# Altium schematic sheet Badge.SchDoc
size A3
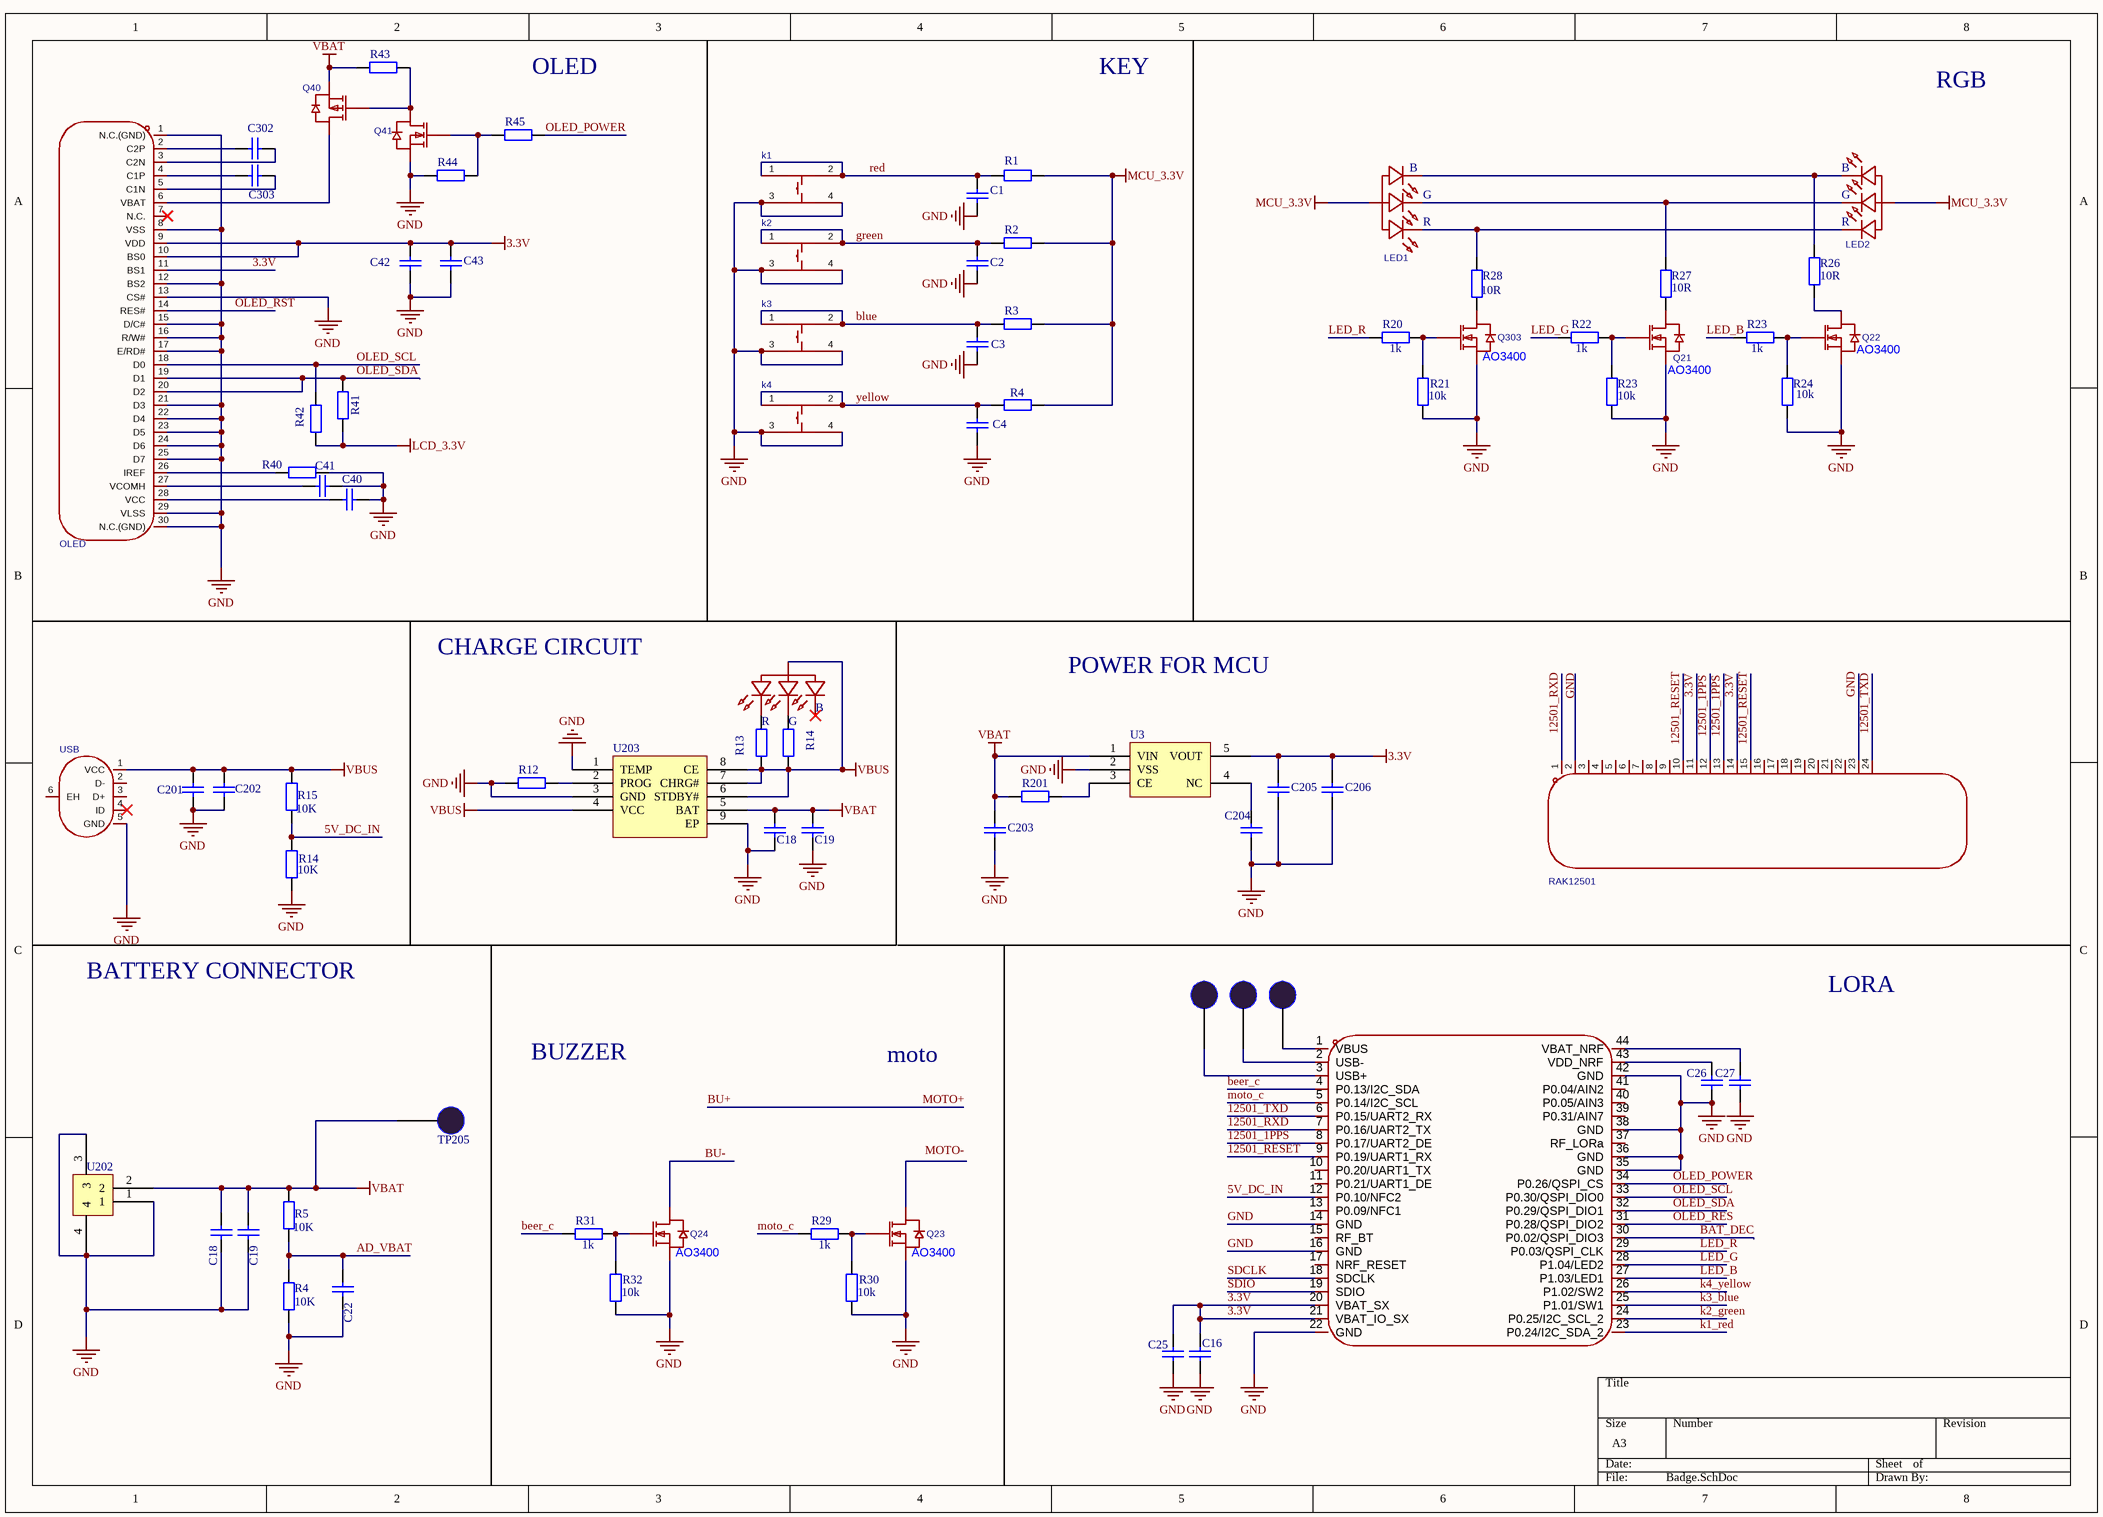
[diagram p0: Badge.SchDoc]

## Parts
(Parts that share a designator on the sheet are numbered #1, #2 ... from top to bottom, then left to right.)
?#1  TP201  (value not drawn)
?#2  TP201  (value not drawn)
?#3  TP201  (value not drawn)
C1  Cap  [RAD-0.3]  (value not drawn)
C2  Cap  [RAD-0.3]  (value not drawn)
C3  Cap  [RAD-0.3]  (value not drawn)
C4  Cap  [RAD-0.3]  (value not drawn)
C16  Cap  [RAD-0.3]  (value not drawn)
C18#1  Cap  [RAD-0.3]  (value not drawn)
C18#2  Cap  [RAD-0.3]  (value not drawn)
C19#1  Cap  [RAD-0.3]  (value not drawn)
C19#2  Cap  [RAD-0.3]  (value not drawn)
C22  Cap  [RAD-0.3]  (value not drawn)
C25  Cap  [RAD-0.3]  (value not drawn)
C26  Cap  [RAD-0.3]  (value not drawn)
C27  Cap  [RAD-0.3]  (value not drawn)
C40  Cap  [RAD-0.3]  (value not drawn)
C41  Cap  [RAD-0.3]  (value not drawn)
C42  Cap  [RAD-0.3]  (value not drawn)
C43  Cap  [RAD-0.3]  (value not drawn)
C201  Cap  [RAD-0.3]  (value not drawn)
C202  Cap  [RAD-0.3]  (value not drawn)
C203  Cap  [RAD-0.3]  (value not drawn)
C204  Cap  [RAD-0.3]  (value not drawn)
C205  Cap  [RAD-0.3]  (value not drawn)
C206  Cap  [RAD-0.3]  (value not drawn)
C302  Cap  [RAD-0.3]  (value not drawn)
C303  Cap  [RAD-0.3]  (value not drawn)
k1  TS-1002S-09026C  (value not drawn)
k2  TS-1002S-09026C  (value not drawn)
k3  TS-1002S-09026C  (value not drawn)
k4  TS-1002S-09026C  (value not drawn)
LED1  XL-3210RGBC-YG  (value not drawn)
LED2  XL-3210RGBC-YG  (value not drawn)
LED?  XL-3210RGBC-YG  (value not drawn)
OLED  N096-2864KSWEG01-H30  (value not drawn)
Q21  AO3400
Q22  AO3400
Q23  AO3400
Q24  AO3400
Q40  AO3407A  (value not drawn)
Q41  AO3400A  (value not drawn)
Q303  AO3400
R1  Res2  [AXIAL-0.4]  (value not drawn)
R2  Res2  [AXIAL-0.4]  (value not drawn)
R3  Res2  [AXIAL-0.4]  (value not drawn)
R4#1  Res2  [AXIAL-0.4]  (value not drawn)
R4#2  10K  [AXIAL-0.4]
R5  10K  [AXIAL-0.4]
R12  Res2  [AXIAL-0.4]  (value not drawn)
R13  Res2  [AXIAL-0.4]  (value not drawn)
R14#1  Res2  [AXIAL-0.4]  (value not drawn)
R14#2  10K  [AXIAL-0.4]
R15  10K  [AXIAL-0.4]
R20  1k  [AXIAL-0.4]
R21  10k  [AXIAL-0.4]
R22  1k  [AXIAL-0.4]
R23#1  1k  [AXIAL-0.4]
R23#2  10k  [AXIAL-0.4]
R24  10k  [AXIAL-0.4]
R26  10R  [AXIAL-0.4]
R27  10R  [AXIAL-0.4]
R28  10R  [AXIAL-0.4]
R29  1k  [AXIAL-0.4]
R30  10k  [AXIAL-0.4]
R31  1k  [AXIAL-0.4]
R32  10k  [AXIAL-0.4]
R40  Res2  [AXIAL-0.4]  (value not drawn)
R41  Res2  [AXIAL-0.4]  (value not drawn)
R42  Res2  [AXIAL-0.4]  (value not drawn)
R43  Res2  [AXIAL-0.4]  (value not drawn)
R44  Res2  [AXIAL-0.4]  (value not drawn)
R45  Res2  [AXIAL-0.4]  (value not drawn)
R201  Res2  [AXIAL-0.4]  (value not drawn)
RAK12501  N096-2864KSWEG01-H30  (value not drawn)
TP205  TP201  (value not drawn)
U3  U201  (value not drawn)
U202  U202  (value not drawn)
U203  Component_1  (value not drawn)
U?  RAK4630-9-SM-I  (value not drawn)
USB  MICRO 4P DIP  (value not drawn)

## Nets
3.3V: C16.2 C25.2 C42.2 C43.2 C205.2 C206.2 OLED.9(VDD) OLED.10(BS0) OLED.11(BS1) RAK12501.11 RAK12501.14 U3.5(VOUT) U?.20(VBAT_SX) U?.21(VBAT_IO_SX)
GND: C1.2 C2.2 C3.2 C4.2 C16.1 C18#1.2 C18#2.2 C19#1.2 C19#2.2 C22.2 C25.1 C26.1 C27.1 C40.1 C41.1 C42.1 C43.1 C201.2 C202.2 C203.1 C204.1 C205.1 C206.1 k1.3 k1.4 k2.3 k2.4 k3.3 k3.4 k4.3 k4.4 OLED.1(N.C.(GND)) OLED.8(VSS) OLED.12(BS2) OLED.13(CS#) OLED.15(D/C#) OLED.16(R/W#) OLED.17(E/RD#) OLED.21(D3) OLED.22(D4) OLED.23(D5) OLED.24(D6) OLED.25(D7) OLED.29(VLSS) OLED.30(N.C.(GND)) Q21.2(S) Q22.2(S) Q23.2(S) Q24.2(S) Q41.2(S) Q303.2(S) R4#2.1 R12.1 R14#2.1 R21.2 R23#2.2 R24.2 R30.2 R32.2 R40.1 R44.2 RAK12501.23 U3.2(VSS) U202.1 U202.3 U202.4 U203.1(TEMP) U203.3(GND) U203.9(EP) U?.14(GND) U?.16(GND) U?.22(GND) U?.35(GND) U?.36(GND) U?.38(GND) U?.42(GND) USB.5(GND)
LCD_3.3V: R41.2 R42.2
MCU_3.3V: LED1.3 LED2.3 R1.1 R2.1 R3.1 R4#1.1
VBAT: C18#1.1 C18#2.1 C19#1.1 C19#2.1 C203.2 Q40.2(S) R5.2 R43.1 R201.1 TP205.16(EP) U3.1(VIN) U202.2 U203.5(BAT)
VBUS: C201.1 C202.1 LED?.3 R13.1 R14#1.1 R15.2 U203.4(VCC) U203.6(STDBY#) U203.7(CHRG#) U203.8(CE) USB.1(VCC)
5V_DC_IN: R14#2.2 R15.1 U?.12(P0.10/NFC2)
12501_1PPS: RAK12501.12 RAK12501.13 U?.8(P0.17/UART2_DE)
12501_RESET: RAK12501.10 RAK12501.15 U?.9(P0.19/UART1_RX)
12501_RXD: RAK12501.1 U?.7(P0.16/UART2_TX)
12501_TXD: RAK12501.24 U?.6(P0.15/UART2_RX)
AD_VBAT: C22.1 R4#2.2 R5.1
BAT_DEC: U?.30(P0.02/QSPI_DIO3)
beer_c: R31.2 U?.4(P0.13/I2C_SDA)
blue: C3.1 k3.1 k3.2 R3.2
BU-: Q24.3(D)
green: C2.1 k2.1 k2.2 R2.2
k1_red: U?.23(P0.24/I2C_SDA_2)
k2_green: U?.24(P0.25/I2C_SCL_2)
k3_blue: U?.25(P1.01/SW1)
k4_yellow: U?.26(P1.02/SW2)
LED_B: R23#1.2 U?.27(P1.03/LED1)
LED_G: R22.2 U?.28(P1.04/LED2)
LED_R: R20.2 U?.29(P0.03/QSPI_CLK)
moto_c: R29.2 U?.5(P0.14/I2C_SCL)
OLED_POWER: R45.2 U?.34(P0.26/QSPI_CS)
OLED_RES: U?.31(P0.28/QSPI_DIO2)
OLED_RST: OLED.14(RES#)
OLED_SCL: OLED.18(D0) R42.1 U?.33(P0.30/QSPI_DIO0)
OLED_SDA: OLED.19(D1) OLED.20(D2) R41.1 U?.32(P0.29/QSPI_DIO1)
red: C1.1 k1.1 k1.2 R1.2
SDCLK: U?.18(SDCLK)
SDIO: U?.19(SDIO)
yellow: C4.1 k4.1 k4.2 R4#1.2
Net?#1_16: ?#1.16(EP) U?.3(USB+)
Net?#2_16: ?#2.16(EP) U?.2(USB-)
Net?#3_16: ?#3.16(EP) U?.1(VBUS)
NetC26_2: C26.2 U?.43(VDD_NRF)
NetC27_2: C27.2 U?.44(VBAT_NRF)
NetC40_2: C40.2 OLED.28(VCC)
NetC41_2: C41.2 OLED.27(VCOMH)
NetC204_2: C204.2 U3.4(NC)
NetC302_1: C302.1 OLED.2(C2P)
NetC302_2: C302.2 OLED.3(C2N)
NetC303_1: C303.1 OLED.4(C1P)
NetC303_2: C303.2 OLED.5(C1N)
NetLED1_1: LED1.1 LED2.1 R27.2
NetLED1_2: LED1.2 LED2.4 R28.1
NetLED1_4: LED1.4 LED2.2 R26.2
NetLED?_1: LED?.1 R14#1.2
NetLED?_2: LED?.2 R13.2
NetOLED_6: OLED.6(VBAT) Q40.3(D)
NetOLED_26: OLED.26(IREF) R40.2
NetQ21_1: Q21.1(G) R22.1 R23#2.1
NetQ21_3: Q21.3(D) R27.1
NetQ22_1: Q22.1(G) R23#1.1 R24.1
NetQ22_3: Q22.3(D) R26.1
NetQ23_1: Q23.1(G) R29.1 R30.1
NetQ24_1: Q24.1(G) R31.1 R32.1
NetQ40_1: Q40.1(G) Q41.3(D) R43.2
NetQ41_1: Q41.1(G) R44.1 R45.1
NetQ303_1: Q303.1(G) R20.1 R21.1
NetQ303_3: Q303.3(D) R28.2
NetR12_2: R12.2 U203.2(PROG)
NetR201_2: R201.2 U3.3(CE)

Not connected (* = marked no-connect by the designer): LED? 4*; OLED 7(N.C.)*; Q23 3(D); RAK12501 2 3 4 5 6 7 8 9 16 17 18 19 20 21 22; U? 10(P0.20/UART1_TX) 11(P0.21/UART1_DE) 13(P0.09/NFC1) 15(RF_BT) 17(NRF_RESET) 37(RF_LORa) 39(P0.31/AIN7) 40(P0.05/AIN3) 41(P0.04/AIN2); USB 2(D-) 3(D+) 4(ID)* 6(EH)

## Notes on the sheet
- OLED
- KEY
- RGB
- (near LED1) B
- (near LED2) B
- (near LED1) G
- (near LED1) R
- (near LED2) G
- (near LED2) R
- CHARGE CIRCUIT
- (near R13) R
- (near R14#1) G
- (near LED?) B
- POWER FOR MCU
- BATTERY CONNECTOR
- LORA
- BUZZER
- moto
- Labels drawn without touching a wire or pin: GND, MOTO-

## Library data of the parts
C1-C4 C16 C18#1 C18#2 C19#1 C19#2 C22 C25-C27 C40-C43 C201-C206 C302 C303 = Cap: Capacitor; Value: 100pF; Published: 8-Jun-2000; LatestRevisionDate: 17-Jul-2002; LatestRevisionNote: Re-released for DXP Platform.; PackageReference: RAD-0.3; Publisher: Altium Limited; PackageDescription: Radial Cap, Thru-Hole; 2 Leads; 0.3 in Pin Spacing
Q21-Q24 Q303 = AO3400A: Symbol: AO3400A
R1-R3 R4#1 R4#2 R5 R12 R13 R14#1 R14#2 R15 R21 R23#2 R24 R26-R28 R30 R32 R40-R45 R201 = Res2: Resistor; Value: 1K; Published: 8-Jun-2000; LatestRevisionDate: 17-Jul-2002; LatestRevisionNote: Re-released for DXP Platform.; PackageReference: AXIAL-0.4; Publisher: Altium Limited; PackageDescription: Axial Device, Thru-Hole; 2 Leads; 0.4 in Pin Spacing
R20 R22 R23#1 R29 R31 = Res2: Resistor; Published: 8-Jun-2000; LatestRevisionDate: 17-Jul-2002; LatestRevisionNote: Re-released for DXP Platform.; PackageReference: AXIAL-0.4; Publisher: Altium Limited; PackageDescription: Axial Device, Thru-Hole; 2 Leads; 0.4 in Pin Spacing; Value: 1K
k1-k4 = TS-1002S-09026C: Symbol: TS-1002S-09026C
LED1 LED2 LED? = XL-3210RGBC-YG: Symbol: XL-3210RGBC-YG
OLED RAK12501 = N096-2864KSWEG01-H30: Symbol: N096-2864KSWEG01-H30
Q40 = AO3407A: Symbol: AO3407A
Q41 = AO3400A: Symbol: AO3400A
U? = RAK4630-9-SM-I: Symbol: RAK4630-9-SM-I
USB = MICRO 4P DIP: Symbol: MICRO 4P DIP